# EAGLE design ext_i2c (EAGLE 7.2.0)
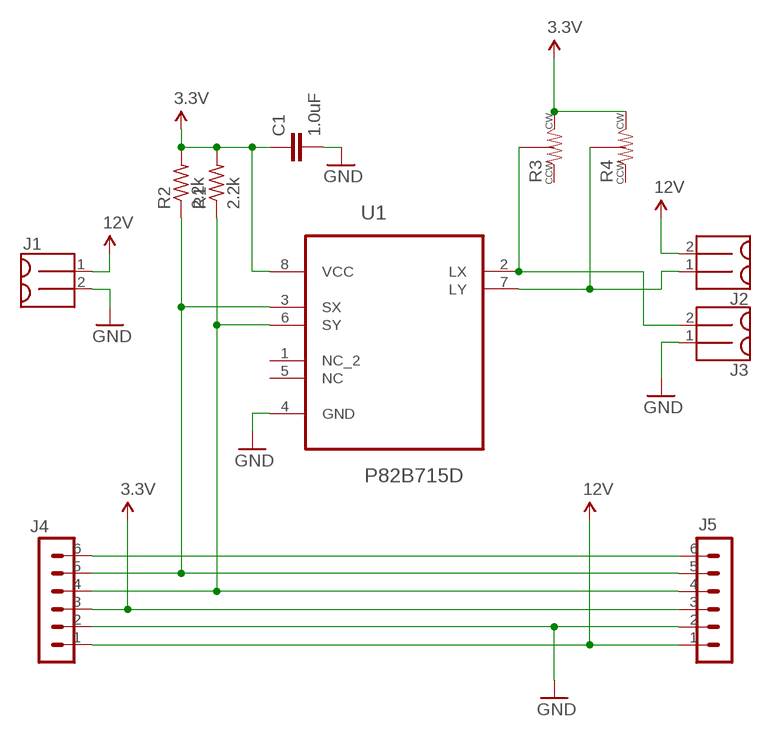
[diagram p0: schematic, sheet 1]

## Parts
C1  1.0uF  1.0UF-16V-10%(0603)  [0603-CAP]
J1  MOLEX_MINILITE_TRAP_2  [MOLEX_MINILITE_TRAP_2]
J2  MOLEX_MINILITE_TRAP_2  [MOLEX_MINILITE_TRAP_2]
J3  MOLEX_MINILITE_TRAP_2  [MOLEX_MINILITE_TRAP_2]
J4  1X06_HEADER_L1X06_EDGE_L  [1X06_EDGE_L]
J5  1X06_HEADER_R1X06_EDGE_R  [1X06_EDGE_R]
R1  2.2k  R-US_R0805  [R0805]
R2  2.2k  R-US_R0805  [R0805]
R3  POT_3MM  [POT_3MM]
R4  POT_3MM  [POT_3MM]
U1  P82B715D  [SOIC127P600X175-8N]

## Nets
3.3V: C1.1 J4.3 J5.3 R1.2 R2.2 R3.3 R4.3 U1.8(VCC)
12V: J1.1 J2.2 J4.1 J5.1
GND: C1.2 J1.2 J3.1 J4.2 J5.2 U1.4(GND)
N$1: J4.6 J5.6
N$2: J4.5 J5.5 R2.1 U1.3(SX)
N$3: J4.4 J5.4 R1.1 U1.6(SY)
N$7: J3.2 R3.2 U1.2(LX)
N$8: J2.1 R4.2 U1.7(LY)
Unconnected: R3.1 R4.1 U1.1(NC_2) U1.5(NC)

## Library data of the parts
C1 = SparkFun-Capacitors:1.0UF-16V-10%(0603): CAP-00868; PROD_ID: CAP-00868
J1-J3 = Puffin:MOLEX_MINILITE_TRAP_2
J4 = Puffin:1X06_HEADER_L
J5 = Puffin:1X06_HEADER_R
R1 R2 = resistor:R-US_: RESISTOR, American symbol
R3 R4 = Puffin:POT_3MM
U1 = Texas Instruments_By_element14_Batch_1:P82B715D: I2C BUS EXTENDER; MPN: P82B715D; OC_FARNELL: 1604945; OC_NEWARK: 84M9793; PACKAGE: SOIC-8; SUPPLIER: Texas Instruments

## Board
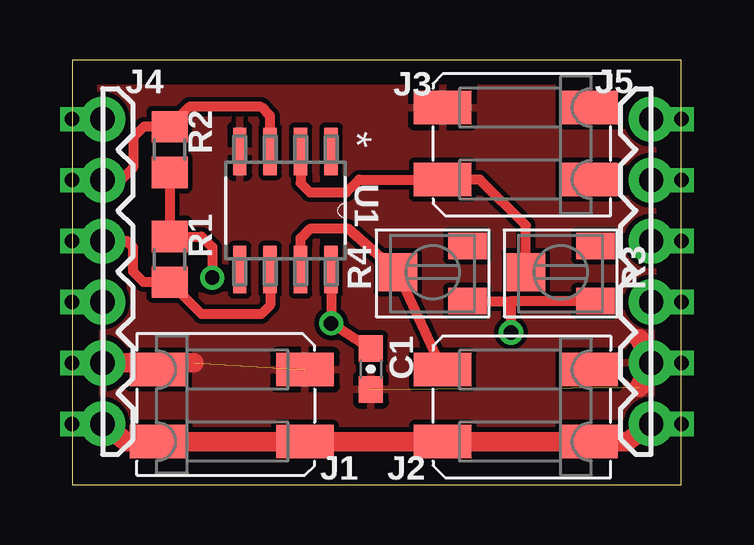
[diagram p1: board, top side]
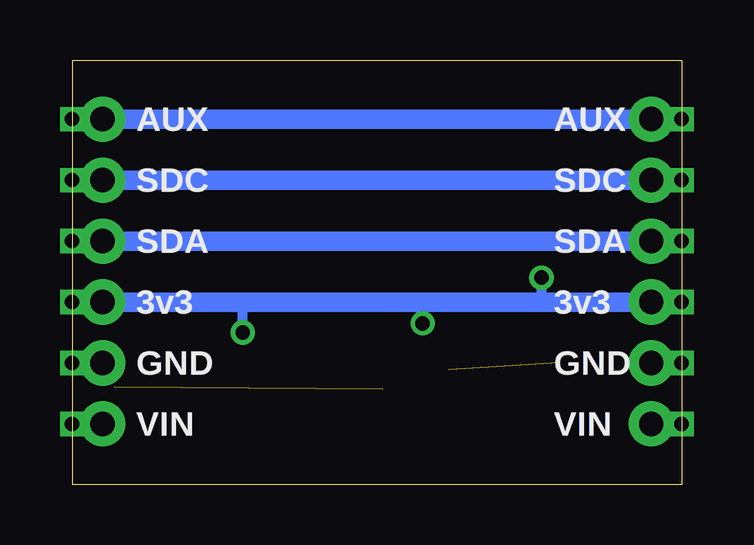
[diagram p2: board, bottom side, seen from below]

Size 25.38 x 17.7 mm. Coordinates in mm from the lower left corner, seen from the top.
Outline: 0,0 25.38,0 25.38,17.7 0,17.7 0,0
Copper layers (1*16): Top 0.035mm / dielectric 1.5mm / Bottom 0.035mm
Design rules "default": minimum track width 10mil, minimum drill 24mil, track to track 8mil, track to pad 8mil, pad to pad 8mil, via to via 8mil, smd to smd 8mil, copper to edge 40mil, drill to drill 8mil, minimum pad ring 10mil, minimum via ring 8mil, stop-mask expansion 4mil, vias tented up to drill 0mil, thermal gap 10mil

### Footprints (pad centres in the part's own frame; a part is rotated, then mirrored left to right if it is on the bottom)
0603-CAP = smd 1.1 x 1: 1 -0.85,0; 2 0.85,0
MOLEX_MINILITE_TRAP_2 = smd 2.4 x 1.4: 1 -3.1,1.5; 2 -3.1,-1.5; 3 3,1.5; 4 3,-1.5
1X06_EDGE_L = drill 1.016 pad 1.88: 1 0,0; 2 0,2.54; 3 0,5.08; 4 0,7.62; 5 0,10.16; 6 0,12.7
1X06_EDGE_R = drill 1.016 pad 1.88: 1 0,0; 2 0,2.54; 3 0,5.08; 4 0,7.62; 5 0,10.16; 6 0,12.7
R0805 = smd 1.3 x 1.5: 1 -0.95,0; 2 0.95,0
POT_3MM = smd 1.1 x 1.6: 1 2.85,0.8; 3 0.55,0.8 | smd 1.6 x 1.6: 2 1.75,3.7
SOIC127P600X175-8N = smd 1.981 x 0.559: 1 -2.464,1.905; 2 -2.464,0.635; 3 -2.464,-0.635; 4 -2.464,-1.905; 5 2.464,-1.905; 6 2.464,-0.635; 7 2.464,0.635; 8 2.464,1.905

### Placement (x,y rotation side)
C1  12.45,4.83 270 top
J1  6.6,3.3 180 top
J2  18.54,3.3 0 top
J3  18.54,14.22 0 top
J4  1.27,2.54 0 top
J5  24.13,2.54 0 top
R1  4.06,9.4 90 top
R2  4.06,13.97 270 top
R3  22.61,7.11 90 top
R4  17.27,7.11 90 top
U1  8.89,11.43 270 top

### Tracks (layer width: path | path; a pad name or v marks a point on that pad's centre or on a via)
3.3V  (via drill 0.6)
  Top 0.406: R2.2 R1.2 5.4,10.35 5.84,9.91 v5.84,8.64 | U1.8 v10.79,6.73 C1.1 | R4.3 18.29,7.66 | 18.29,7.66 v18.29,6.35 | R3.3 18.29,7.66
  Bottom 0.406: v5.84,8.64 5.84,7.62 | v10.79,6.73 10.9,7.62 | v18.29,6.35 18.29,7.37 18.03,7.62
  Bottom 0.813: J4.3 5.84,7.62 10.9,7.62 18.03,7.62 J5.3
12V
  Top 0.813: J4.1 2.26,1.8 J1.1 J2.2 23.14,1.8 J5.1
GND  (2 unrouted)
  Top 0.813: J4.2 5.08,5.08 | 23.62,4.06 J5.2 23.62,6.1
  pour Top: -1.27,-0.76 26.42,-0.76 26.42,18.29 -1.27,18.29
N$1
  Bottom 0.813: J5.6 J4.6
N$2
  Top 0.406: J4.5 2.03,12.7 2.54,13.21 2.54,14.48 2.98,14.92 R2.1 4.89,15.75 7.87,15.75 8.26,15.37 U1.3
  Bottom 0.813: J4.5 J5.5
N$3
  Top 0.406: U1.6 8.26,7.49 7.87,7.11 5.4,7.11 R1.1 2.98,8.45 2.54,8.89 2.54,9.91 2.29,10.16 J4.4
  Bottom 0.813: J5.4 J4.4
N$4  (via drill 0.6)
  other vias: 25.4,15.24
N$5  (via drill 0.6)
  other vias: 25.4,12.7
N$6  (via drill 0.6)
  other vias: 25.4,10.16
N$7
  Top 0.406: R3.2 18.91,10.81 16.99,12.72 J3.2 11.96,12.72 11.43,12.19 9.91,12.19 9.53,12.57 U1.2
N$8
  Top 0.406: U1.7 9.53,10.29 9.91,10.67 11.51,10.67 R4.2 J2.1
N$9  (via drill 0.6)
  other vias: 25.4,7.62
N$10  (via drill 0.6)
  other vias: 25.4,5.08
N$11  (via drill 0.6)
  other vias: 25.4,2.54
N$12  (via drill 0.6)
  other vias: 0,15.24
N$13  (via drill 0.6)
  other vias: 0,12.7
N$14  (via drill 0.6)
  other vias: 0,10.16
N$15  (via drill 0.6)
  other vias: 0,7.62
N$16  (via drill 0.6)
  other vias: 0,5.08
N$17  (via drill 0.6)
  other vias: 0,2.54